# Altium schematic sheet QPB-V1.SchDoc: QUAN POWER BOARD VERSION 1
size 359 x 170 mm; PageSetup: Record=PageOptions|CenterHorizontal=True|CenterVertical=True|PrintScale=0.81|XCorrection=1.00|YCorrection=1.00|PrintKind=0|BorderSize=5000000|LeftOffset=0|BottomOffset=0|Orientation=2|PaperLength=1000|PaperWidth=1000|Scale=100|PaperSource=7|PrintQuality=-4|MediaType=1|DitherType=10|PaperKind=A4|PrintScaleMode=1
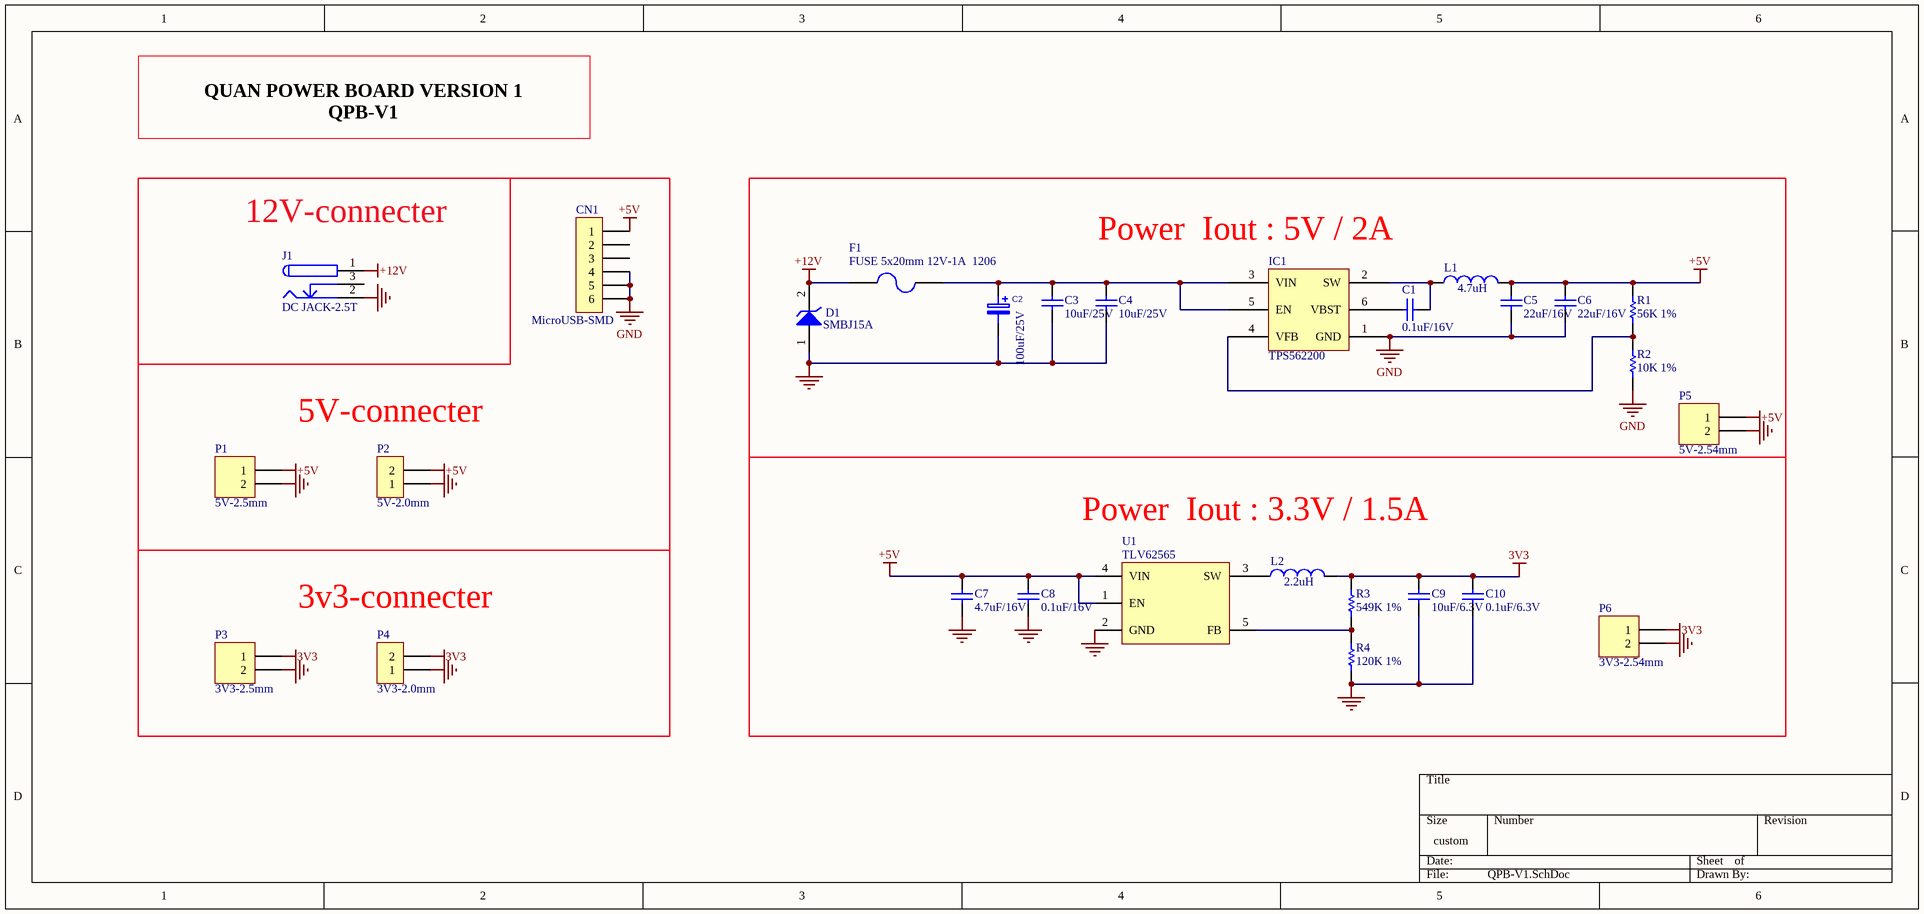
[diagram p0: QPB-V1.SchDoc]

## Parts
C1  0.1uF/16V  [0603C]
C2  100uF/25V  [DIP CAP-6.5*2.54]
C3  10uF/25V  [0603C]
C4  10uF/25V  [0603C]
C5  22uF/16V  [0603C]
C6  22uF/16V  [0603C]
C7  4.7uF/16V  [0603C]
C8  0.1uF/16V  [0603C]
C9  10uF/6.3V  [0603C]
C10  0.1uF/6.3V  [0603C]
CN1  MicroUSB-SMD  [USB--MICRO-WMRU2-05FLBSRF]
D1  SMBJ15A  [SMBJ40CA(TVS)]
F1  FUSE 5x20mm 12V-1A  1206  [1206-FUSE]
IC1  TPS562200  [SOT-23-6-0.95mm]
J1  DC JACK-2.5T  [DC JACK-2.5T-NEW]
L1  4.7uH  [L3X3.5]
L2  2.2uH  [L3X3.5]
P1  5V-2.5mm  [WHITEWAFER2-25]
P2  5V-2.0mm  [WHITEWAFER2-200]
P3  3V3-2.5mm  [WHITEWAFER2-25]
P4  3V3-2.0mm  [WHITEWAFER2-200]
P5  5V-2.54mm  [HDR1X2]
P6  3V3-2.54mm  [HDR1X2]
R1  56K 1%  [0603]
R2  10K 1%  [0603]
R3  549K 1%  [0603]
R4  120K 1%  [0603]
U1  TLV62565  [SOT-23-5-0.95MM]

## Nets
3V3: C9.2 C10.2 L2.2 P3.1 P4.2 P6.1 R3.2
+5V: C5.2 C6.2 C7.2 C8.2 CN1.1 L1.2 P1.1 P2.2 P5.1 R1.2 U1.1(EN) U1.4(VIN)
+12V: D1.2 F1.1 J1.1
GND: C2.2 C3.1 C4.1 C5.1 C6.1 C7.1 C8.1 C9.1 C10.1 CN1.4 CN1.5 CN1.6 D1.1 IC1.1(GND) J1.2 P1.2 P2.1 P3.2 P4.1 P5.2 P6.2 R2.1 R4.1 U1.2(GND)
NetC1_1: C1.1 IC1.2(SW) L1.1
NetC1_2: C1.2 IC1.6(VBST)
NetC2_1: C2.1 C3.2 C4.2 F1.2 IC1.3(VIN) IC1.5(EN)
NetIC1_4: IC1.4(VFB) R1.1 R2.2
NetL2_1: L2.1 U1.3(SW)
NetR3_1: R3.1 R4.2 U1.5(FB)

Not connected (* = marked no-connect by the designer): CN1 2 3; J1 3

## Notes on the sheet
- QUAN POWER BOARD VERSION 1
  QPB-V1
- (near J1) 12V-connecter
- Power  Iout : 5V / 2A
- 5V-connecter
- Power  Iout : 3.3V / 1.5A
- 3v3-connecter

## Library data of the parts
C1 C3-C10 = Cap Semi: Capacitor (Semiconductor SIM Model); Published: 8-Jun-2000; LatestRevisionDate: 17-Jul-2002; LatestRevisionNote: Re-released for DXP Platform.; PackageReference: C1206; Publisher: Altium Limited
  C1: Value: 0.1uF/16V; NC: NC
  C3 C4: Value: 10uF/25V
  C5 C6: Value: 22uF/16V
  C7: Value: 4.7uF/16V
  C8: Value: 0.1uF/16V
  C9: Value: 10uF/6.3V
  C10: Value: 0.1uF/6.3V
C2 = C POL: Part Number: 53300833000; Right: 20; Tolerance: 20%; Rating: 10V; Package Height: 1.8mm; PCB_x: 19.129500; PCB_y: 12.184000; PCB_dir: 0.000000; PCB_loc: Top; Bottom: 20; VALUE_ALLEGRO: 100uF/25V
CN1 = CON6: Connector; Value: MicroUSB
D1 = PESD5V0L1BA: Zener Diode
F1 = FUSE2: Fuse
J1 = DCJACK-1: Low Voltage Power Supply Connector; Published: *; DatasheetDocument: *; Publisher: *; ComponentLink1Description: *; ComponentLink1URL: *
L1 = Inductor: Code_IEC: 1005; Published: 8-Jun-2000; LatestRevisionDate: 17-Jul-2002; LatestRevisionNote: Re-released for DXP Platform.; PackageReference: 0402-A; Publisher: Altium Limited; Code_JEITA: 0402; Value: 4.7uH
L2 = L
P1 P3 P5 P6 = Header 2: Header, 2-Pin; LatestRevisionDate: 17-Jul-2002; LatestRevisionNote: Re-released for DXP Platform.; Publisher: Altium Limited
P2 P4 = 2PIN-200: Connector
R1-R4 = Res Semi: Semiconductor Resistor; Published: 8-Jun-2000; LatestRevisionDate: 17-Jul-2002; LatestRevisionNote: Re-released for DXP Platform.; PackageReference: AXIAL-0.5; Publisher: Altium Limited
  R1: Value: 56K 1%
  R2: Value: 10K 1%
  R3: Value: 549K 1%
  R4: Value: 120K 1%
U1 = TL62565